# Altium schematic sheet Battery_Operated Node.SchDoc: Battery Oprated node
size OrCAD C; Date: 3/26/2015 6:39:54 PM; ApprovedBy: Approved By:; CheckedBy: Checked By:; Author: Auther:; CompanyName: Souliss; DrawnBy: Yoosof Piran; Engineer: Yoosof Piran; Revision: None; SheetNumber: 1; Design by:: Design by:Yoosof Piran; ProjectName: Battery Operated Nodes
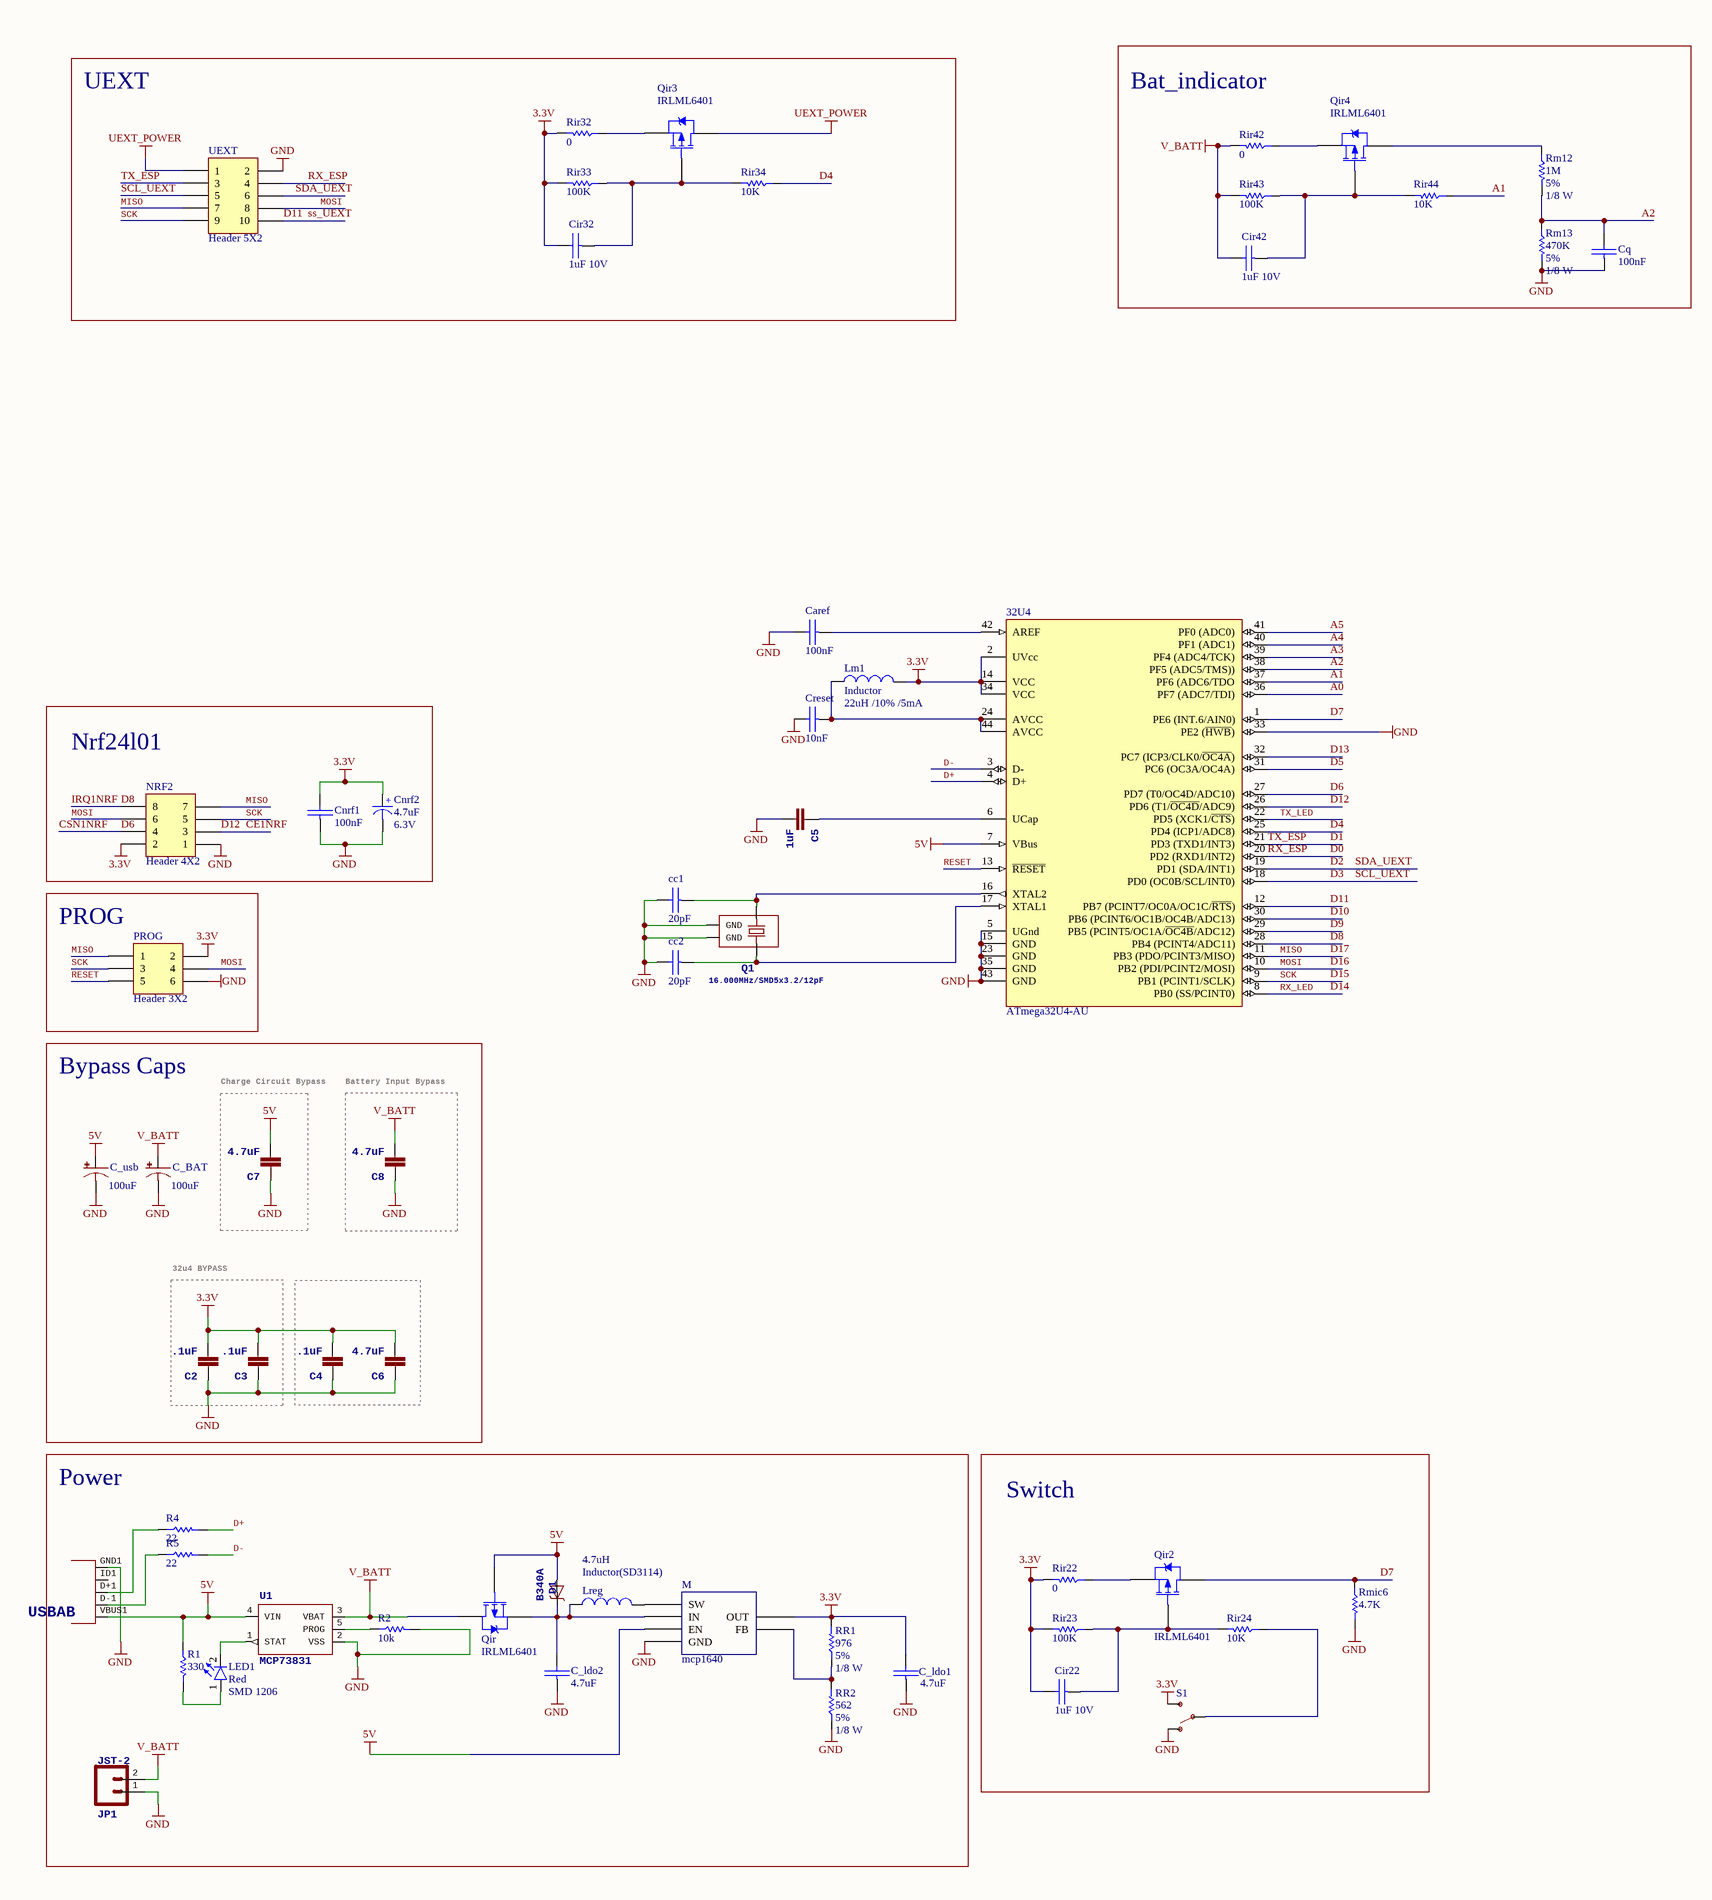
[diagram p0: Battery_Operated Node.SchDoc, left]
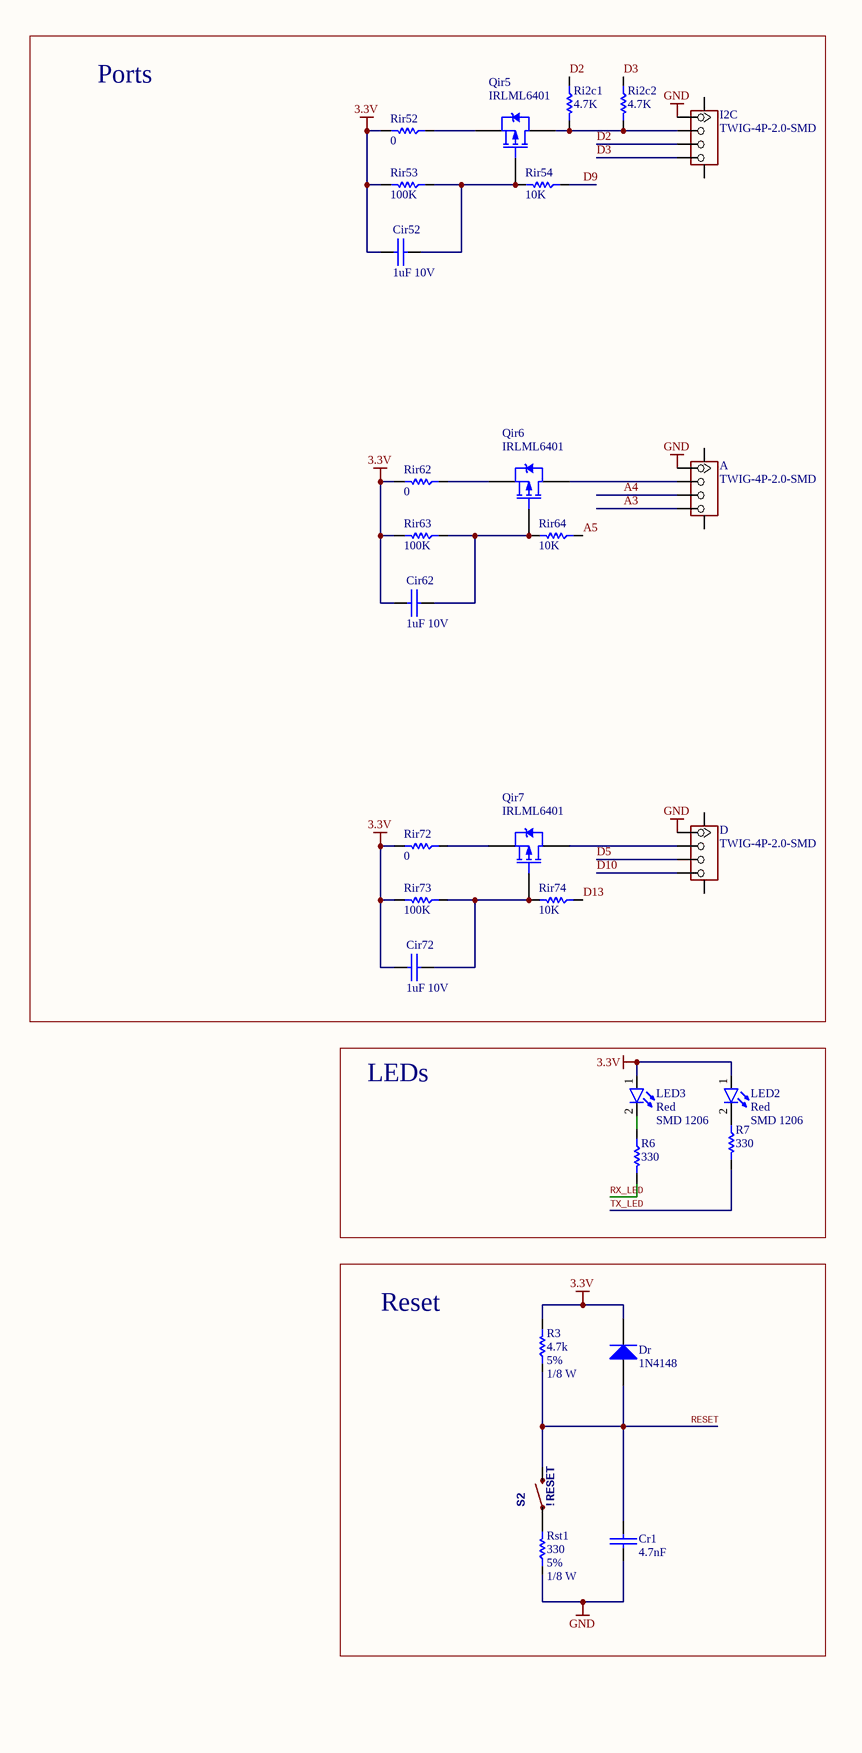
[diagram p1: Battery_Operated Node.SchDoc, right]

## Parts
32U4  ATmega32U4-AU  [44ML_N]
A  TWIG-4P-2.0-SMD  [4P-SMD-2.0]
C2  .1uF  [0603-CAP]
C3  .1uF  [0603-CAP]
C4  .1uF  [0603-CAP]
C5  1uF  [0603-CAP]
C6  4.7uF  [0603-CAP]
C7  4.7uF  [1206]
C8  4.7uF  [1206]
C_BAT  100uF  [PANASONIC_D]
C_ldo1  4.7uF  [SMD_CAP_1206]
C_ldo2  4.7uF  [SMD_CAP_1206]
C_usb  100uF  [PANASONIC_D]
Caref  100nF  [SMD_CAP_0805]
cc1  20pF  [SMD_CAP_0603]
cc2  20pF  [SMD_CAP_0603]
Cir22  1uF 10V  [SMD_CAP_0603]
Cir32  1uF 10V  [SMD_CAP_0805]
Cir42  1uF 10V  [SMD_CAP_0805]
Cir52  1uF 10V  [SMD_CAP_0805]
Cir62  1uF 10V  [SMD_CAP_0805]
Cir72  1uF 10V  [SMD_CAP_0805]
Cnrf1  100nF  [SMD_CAP_0805]
Cnrf2  Voltage: 6.3V  [CAPP 1206 (3216X18L) Size A]  (hidden comment: 4.7uF)
Cq  100nF  [SMD_CAP_0805]
Cr1  4.7nF  [SMD_CAP_0805]
Creset  10nF  [SMD_CAP_0805]
D  TWIG-4P-2.0-SMD  [4P-SMD-2.0]
D1  B340A  [SMA-DIODE]
Dr  1N4148  [LL4148]
I2C  TWIG-4P-2.0-SMD  [4P-SMD-2.0]
JP1  JST-2  [JST-2-SMD]
LED1  Size: SMD 1206  [LED SMD 1206]  (hidden comment: Red)
LED2  Size: SMD 1206  [LED SMD 1206]  (hidden comment: Red)
LED3  Size: SMD 1206  [LED SMD 1206]  (hidden comment: Red)
Lm1  Inductor  value 22uH /10% /5mA  [INDC3216]
Lreg  Inductor(SD3114)  value 4.7uH  [INDC4532]
M  mcp1640  [MCP1640]
NRF2  Header 4X2  [HDR2X4]
PROG  Header 3X2  [HDR2X3]
Q1  16.000MHz/SMD5x3.2/12pF  [CRYSTAL_SMD]
Qir  IRLML6401  [Micro3_N]
Qir2  IRLML6401  [Micro3_N]
Qir3  IRLML6401  [Micro3_N]
Qir4  IRLML6401  [Micro3_N]
Qir5  IRLML6401  [Micro3_N]
Qir6  IRLML6401  [Micro3_N]
Qir7  IRLML6401  [Micro3_N]
R1  330  [RES 0805 (2012X06L)]
R2  10k  [RES 0805 (2012X06L)]
R3  Tolerance: 5%  Power: 1/8 W  [RES 0805 (2012X06L)]  (hidden comment: 4.7k)
R4  22  [RES 0805 (2012X06L)]
R5  22  [RES 0805 (2012X06L)]
R6  330  [RES 0805 (2012X06L)]
R7  330  [RES 0805 (2012X06L)]
Ri2c1  4.7K  [RES 0603 (1608X06L)]
Ri2c2  4.7K  [RES 0603 (1608X06L)]
Rir22  0  [RES 0603 (1608X06L)]
Rir23  100K  [RES 0603 (1608X06L)]
Rir24  10K  [RES 0603 (1608X06L)]
Rir32  0  [RES 0805 (2012X06L)]
Rir33  100K  [RES 0805 (2012X06L)]
Rir34  10K  [RES 0805 (2012X06L)]
Rir42  0  [RES 0805 (2012X06L)]
Rir43  100K  [RES 0805 (2012X06L)]
Rir44  10K  [RES 0805 (2012X06L)]
Rir52  0  [RES 0805 (2012X06L)]
Rir53  100K  [RES 0805 (2012X06L)]
Rir54  10K  [RES 0805 (2012X06L)]
Rir62  0  [RES 0805 (2012X06L)]
Rir63  100K  [RES 0805 (2012X06L)]
Rir64  10K  [RES 0805 (2012X06L)]
Rir72  0  [RES 0805 (2012X06L)]
Rir73  100K  [RES 0805 (2012X06L)]
Rir74  10K  [RES 0805 (2012X06L)]
Rm12  Tolerance: 5%  Power: 1/8 W  [RES 0805 (2012X06L)]  (hidden comment: 1M)
Rm13  Tolerance: 5%  Power: 1/8 W  [RES 0805 (2012X06L)]  (hidden comment: 470K)
Rmic6  4.7K  [RES 0603 (1608X06L)]
RR1  Tolerance: 5%  Power: 1/8 W  [RES 0805 (2012X06L)]  (hidden comment: 976)
RR2  Tolerance: 5%  Power: 1/8 W  [RES 0805 (2012X06L)]  (hidden comment: 562)
Rst1  Tolerance: 5%  Power: 1/8 W  [RES 0805 (2012X06L)]  (hidden comment: 330)
S1  (no value)  [SWITCH-SPDT-SMD]
S2  !RESET  [TACTILE_SWITCH_SMD]
U1  MCP73831  [SOT23-5]
U5  USB-ABCONN-11794  [USB-AB-MICRO-SMD_V03]  (value not drawn)
UEXT  Header 5X2  [HDR2X5]

## Blocks framed on the sheet
Ports: A Cir52 Cir62 Cir72 D I2C Qir5-Qir7 Ri2c1 Ri2c2 Rir52-Rir54 Rir62-Rir64 Rir72-Rir74
UEXT: Cir32 Qir3 Rir32-Rir34 UEXT
Bat_indicator: Cir42 Cq Qir4 Rir42-Rir44 Rm12 Rm13
Nrf24l01: Cnrf1 Cnrf2 NRF2
PROG: PROG
LEDs: LED2 LED3 R6 R7
Bypass Caps: C4 C6 C_BAT C_usb
Charge Circuit Bypass: C7
Battery Input Bypass: C8
Reset: Cr1 Dr R3 Rst1 S2
32u4 BYPASS: C2 C3
Power: C_ldo1 C_ldo2 D1 JP1 LED1 Lreg M Qir R1 R2 R4 R5 RR1 RR2 U1 U5
Switch: Cir22 Qir2 Rir22-Rir24 Rmic6 S1

## Nets
3.3V: 32U4.2(UVcc) 32U4.14(VCC) 32U4.34(VCC) C2.2 C3.2 C4.2 C6.2 C_ldo1.1(+) Cir22.1(+) Cir32.1(+) Cir52.1(+) Cir62.1(+) Cir72.1(+) Cnrf1.1(+) Cnrf2.1(+) Dr.2(K) LED2.1(A) LED3.1(A) Lm1.2 M.5(OUT) NRF2.2 PROG.2 R3.2 Rir22.2 Rir23.2 Rir32.2 Rir33.2 Rir52.2 Rir53.2 Rir62.2 Rir63.2 Rir72.2 Rir73.2 RR1.2 S1.3(S)
5V: 32U4.7(VBus) C7.2 C_usb.+ D1.A M.3(EN) Qir.1(G) R1.1 U1.4(VIN) U5.VBUS1(VBUS)
GND: 32U4.5(UGnd) 32U4.15(GND) 32U4.23(GND) 32U4.33(PE2_(~{HWB})) 32U4.35(GND) 32U4.43(GND) A.1 C2.1 C3.1 C4.1 C5.2 C6.1 C7.1 C8.1 C_BAT.- C_ldo1.2(-) C_ldo2.2(-) C_usb.- Caref.1(+) cc1.1(+) cc2.1(+) Cnrf1.2(-) Cnrf2.2(-) Cq.2(-) Cr1.2(-) Creset.1(+) D.1 I2C.1 JP1.1 M.2(GND) NRF2.1 PROG.6 Q1.NC_1(GND) Q1.NC_2(GND) R2.2 Rm13.2 Rmic6.2 RR2.1 Rst1.1 S1.1(O) U1.2(VSS) U5.GND1(GND) UEXT.2
UEXT_POWER: Qir3.3(D) UEXT.1
V_BATT: C8.2 C_BAT.+ Cir42.1(+) JP1.2 Qir.3(D) Rir42.2 Rir43.2 U1.3(VBAT)
A0: 32U4.36(PF7_(ADC7/TDI))
A1: 32U4.37(PF6_(ADC6/TDO) Rir44.1
A2: 32U4.38(PF5_(ADC5/TMS))) Cq.1(+) Rm12.2 Rm13.1
A3: 32U4.39(PF4_(ADC4/TCK)) A.4
A4: 32U4.40(PF1_(ADC1)) A.3
A5: 32U4.41(PF0_(ADC0)) Rir64.1
CE1NRF: 32U4.26(PD6_(T1/~{OC4D}/ADC9)) NRF2.3  [also labelled D12]
CSN1NRF: 32U4.27(PD7_(T0/OC4D/ADC10)) NRF2.4  [also labelled D6]
D0: 32U4.20(PD2_(RXD1/INT2)) UEXT.4  [also labelled RX_ESP]
D1: 32U4.21(PD3_(TXD1/INT3)) UEXT.3  [also labelled TX_ESP]
D2: 32U4.19(PD1_(SDA/INT1)) I2C.3 Ri2c1.1 UEXT.6  [also labelled SDA_UEXT]
D3: 32U4.18(PD0_(OC0B/SCL/INT0)) I2C.4 Ri2c2.1 UEXT.5  [also labelled SCL_UEXT]
D4: 32U4.25(PD4_(ICP1/ADC8)) Rir34.1
D5: 32U4.31(PC6_(OC3A/OC4A)) D.3
D7: 32U4.1(PE6_(INT.6/AIN0)) Qir2.3(D) Rmic6.1
D8: 32U4.28(PB4_(PCINT4/ADC11)) NRF2.8  [also labelled IRQ1NRF]
D9: 32U4.29(PB5_(PCINT5/OC1A/~{OC4B}/ADC12)) Rir54.1
D10: 32U4.30(PB6_(PCINT6/OC1B/OC4B/ADC13)) D.4
D11: 32U4.12(PB7_(PCINT7/OC0A/OC1C/~{RTS})) UEXT.10  [also labelled ss_UEXT]
D13: 32U4.32(PC7_(ICP3/CLK0/~{OC4A})) Rir74.1
D14: 32U4.8(PB0_(SS/PCINT0)) R6.2  [also labelled RX_LED]
D15: 32U4.9(PB1_(PCINT1/SCLK)) NRF2.5 PROG.3 UEXT.9  [also labelled SCK]
D16: 32U4.10(PB2_(PDI/PCINT2/MOSI)) NRF2.6 PROG.4 UEXT.8  [also labelled MOSI]
D17: 32U4.11(PB3_(PDO/PCINT3/MISO)) NRF2.7 PROG.1 UEXT.7  [also labelled MISO]
D+: 32U4.4(D+) R4.2
D-: 32U4.3(D-) R5.2
RESET: 32U4.13(~{RESET}) Cr1.1(+) Dr.1(A) PROG.5 R3.1 S2.3
TX_LED: 32U4.22(PD5_(XCK1/~{CTS})) R7.2
Net32U4_6: 32U4.6(UCap) C5.1
Net32U4_16: 32U4.16(XTAL2) cc1.2(-) Q1.2
Net32U4_17: 32U4.17(XTAL1) cc2.2(-) Q1.1
Net32U4_24: 32U4.24(AVCC) 32U4.44(AVCC) Creset.2(-) Lm1.1
Net32U4_42: 32U4.42(AREF) Caref.2(-)
NetA_2: A.2 Qir6.3(D)
NetC_ldo2_1: C_ldo2.1(+) D1.C Lreg.1 M.6(IN) Qir.2(S)
NetCir22_2: Cir22.2(-) Qir2.1(G) Rir23.1 Rir24.2
NetCir32_2: Cir32.2(-) Qir3.1(G) Rir33.1 Rir34.2
NetCir42_2: Cir42.2(-) Qir4.1(G) Rir43.1 Rir44.2
NetCir52_2: Cir52.2(-) Qir5.1(G) Rir53.1 Rir54.2
NetCir62_2: Cir62.2(-) Qir6.1(G) Rir63.1 Rir64.2
NetCir72_2: Cir72.2(-) Qir7.1(G) Rir73.1 Rir74.2
NetD_2: D.2 Qir7.3(D)
NetI2C_2: I2C.2 Qir5.3(D) Ri2c1.2 Ri2c2.2
NetLED1_1: LED1.1(A) R1.2
NetLED1_2: LED1.2(K) U1.1(STAT)
NetLED2_2: LED2.2(K) R7.1
NetLED3_2: LED3.2(K) R6.1
NetLreg_2: Lreg.2 M.1(SW)
NetM_4: M.4(FB) RR1.1 RR2.2
NetQir2_2: Qir2.2(S) Rir22.1
NetQir3_2: Qir3.2(S) Rir32.1
NetQir4_2: Qir4.2(S) Rir42.1
NetQir4_3: Qir4.3(D) Rm12.1
NetQir5_2: Qir5.2(S) Rir52.1
NetQir6_2: Qir6.2(S) Rir62.1
NetQir7_2: Qir7.2(S) Rir72.1
NetR2_1: R2.1 U1.5(PROG)
NetR4_1: R4.1 U5.D+1(D+)
NetR5_1: R5.1 U5.D-1(D-)
NetRir24_1: Rir24.1 S1.2(P)
NetRst1_2: Rst1.2 S2.1

Not connected (* = marked no-connect by the designer): A SS1 SS2; D SS1 SS2; I2C SS1 SS2; U5 ID1(USBID)

## Notes on the sheet
- Title
- Size:
- Date:
- File:
- Orcad C
- Number:
- Time:
- Revision:
- Sheet
- of

## Library data of the parts
32U4 = ATmega32U4-AU: 8-bit AVR Microcontroller, 2.7-5.5V, 32KB Flash, 2.5KB EEPROM, 1KB SRAM, USB Controller, 44-pin TQFP, Industrial Grade (-40°C to 85°C); Published: 1-Apr-2010; DatasheetVersion: revD, Jan-2009; PackageVersion: rev.G, Jul-2007; PackageReference: 44ML; Publisher: Altium Limited; PackageDescription: 44-Pin Plastic Thin Quad Flat Pack, 10 x 10 x 1.0 mm Body, 0.8 mm Pitch (TQFP); Supplier 1: Digi-Key; Supplier Part Number 1: ATMEGA32U4-AU-ND; Supplier 2: Farnell; Supplier Part Number 2: 1748525; Supplier 3: Mouser; Supplier Part Number 3: 556-ATMEGA32U4-AU; ComponentLink1Description: Manufacturer Link; ComponentLink1URL: http://www.atmel.com/products/avr/default.asp?; ComponentLink2Description: ATmega16U4/32U4 Datasheet; ComponentLink2URL: http://www.atmel.com/dyn/resources/prod_documents/doc7766.pdf; ComponentLink3Description: ATmega16U4 ATmega32U4 Summary; ComponentLink3URL: http://www.atmel.com/dyn/resources/prod_documents/7766S.pdf; ComponentLink4Description: Atmel.com Home; ComponentLink4URL: http://www.atmel.com
A D I2C = TWIG-4P-2.0-SMD-FEMALE-REINFORCE'DD'
C2-C4 = CAP0603-CAP: ceramic capacitor; PROD_ID: CAP-00810
C5 = CAP0603-CAP: ceramic capacitor; PROD_ID: CAP-00868
C6 = CAP0603-CAP: ceramic capacitor; PROD_ID: CAP-08280
C7 C8 = CAP1206: ceramic capacitor; PROD_ID: CAP-10300
C_BAT C_usb = CAP_POLD: Polar Capacitor 6.3V; VALUE: 100uF
C_ldo1 C_ldo2 Caref cc1 cc2 Cir22 Cir32 Cir42 Cir52 Cir62 Cir72 Cnrf1 Cq Cr1 Creset = Cap-Bipolar: ceramic capacitor; Voltage: 100V; Designer: Saeid Jorablo; Organazation: ControTec; Adding Date: 1387/12/20
  C_ldo1 C_ldo2: Value: 4.7uF
  Caref Cnrf1 Cq: Value: 100nF
  cc1 cc2: Value: 20pF
  Cir22 Cir32 Cir42 Cir52 Cir62 Cir72: Value: 1uF 10V
  Cr1: Value: 4.7nF
  Creset: Value: 10nF
Cnrf2 = Cap-Polar: Polar Capacitor; Designer: Saeid Jorablo; Organazation: ControTec; Adding Date: 1387/12/20; Value: 4.7uF
D1 = DIODE-SCHOTTKY-B340A: Schottky diodes in SFE's production catalog<p> / BAT20J 1A 23V 0.62Vf<br> / RB751 120mA 40V 0.37Vf<br> / PMEG4005EJ 0.5A 40V 0.42Vf<br> / MBRA140 1A 40V 0.5Vf<br> / B340A  3A 40V SMA <br>
Dr = Diode 1N4148: High Conductance Fast Diode; Published: 8-Jun-2000; LatestRevisionDate: 17-Jul-2002; LatestRevisionNote: Re-released for DXP Platform.; DatasheetVersion: 1997; PackageReference: DO-35; Publisher: Altium Limited; PackageDescription: Diode, Axial; Body 3.8 x 1.9 mm (LxDia. max), Lead Dia. 0.53 mm (max); Code_JEDEC: DO-204-AH; ComponentLink1Description: Manufacturer Link; ComponentLink1URL: http://www.fairchildsemi.com/; ComponentLink2Description: Datasheet; ComponentLink2URL: http://www.fairchildsemi.com/ds/1N%2F1N4148.pdf
JP1 = M02-JST-2MM-SMT: Standard 2-pin 0.1" header. Use with <br> / - straight break away headers ( PRT-00116)<br> / - right angle break away headers (PRT-00553)<br> / - swiss pins (PRT-00743)<br> / - machine pins (PRT-00117)<br> / - female headers (PRT-00115)<br><br> / Molex polarized connector foot print use with: PRT-08233 with associated crimp pins and housings.<br><br> / 2.54_SCREWTERM for use with  PRT-10571.<br><br> / 3.5mm Screw Terminal footprints for  PRT-08084<br><br> / 5mm Screw Terminal footprints for use with PRT-08433; PROD_ID: CONN-08352
LED1-LED3 = LED: Designer: Saeid Jorablo; Organazation: ControTec; Adding Date: 1387/12/22; Color: Red
Lm1 = Inductor: Code_IEC: 1005; Published: 8-Jun-2000; LatestRevisionDate: 29-May-2009; LatestRevisionNote: IPC-7351 Footprint Added.; PackageReference: 0402-A; Publisher: Altium Limited; PackageDescription: Chip Inductor; Code_JEITA: 0402
Lreg = Inductor: Inductor SD3114; Code_IEC: 1005; Published: 8-Jun-2000; LatestRevisionDate: 29-May-2009; LatestRevisionNote: IPC-7351 Footprint Added.; PackageReference: 0402-A; Publisher: Altium Limited; PackageDescription: Chip Inductor; Code_JEITA: 0402
M = mcp1640: MCP1640DT-I/CHY , 0.65V, Sync Reg., 6LD SOT-23 pkg
NRF2 = Header 4X2: Header, 4-Pin, Dual row; Revision: 17-Jul-2002: Re-released for DXP Platform.; Publisher: Altium Limited
PROG = Header 3X2: Header, 3-Pin, Dual row; Revision: 17-Jul-2002: Re-released for DXP Platform.; Publisher: Altium Limited
Q1 = SMALL_SMD_CRYSTAL
Qir Qir2-Qir7 = IRLML6401: HEXFET Power MOSFET; Published: 17-Sep-2003; DatasheetVersion: 2-Jul-2001; PackageVersion: Jul-2001; PackageReference: Micro3; Publisher: Altium Limited; PackageDescription: 3-Pin SOT-23 Package 0.95 mm Pitch, 2.3 mm Lead Span; ComponentLink1Description: Manufacturer Link; ComponentLink1URL: http://www.irf.com/; ComponentLink2Description: Datasheet; ComponentLink2URL: http://www.irf.com/product-info/datasheets/data/IRLML6401.pdf
R1 R2 R4-R7 Ri2c1 Ri2c2 Rir22 Rir23 Rir32 Rir33 Rir42 Rir43 Rir52 Rir53 Rir62 Rir63 Rir72 Rir73 Rmic6 = Resistor: Tolerance: 5%; Power: 1/8 W
  R1 R6 R7: Value: 330
  R2: Value: 10k
  R4 R5: Value: 22
  Ri2c1 Ri2c2 Rmic6: Value: 4.7K
  Rir22 Rir32 Rir42 Rir52 Rir62 Rir72: Value: 0
  Rir23 Rir33 Rir43 Rir53 Rir63 Rir73: Value: 100K
R3 Rm12 Rm13 RR1 RR2 Rst1 = Resistor
  R3: Value: 4.7k
  Rm12: Value: 1M
  Rm13: Value: 470K
  RR1: Value: 976
  RR2: Value: 562
  Rst1: Value: 330
Rir24 Rir34 Rir44 Rir54 Rir64 Rir74 = Resistor: Power: 1/8 W; Value: 10K
S1 = SWITCH-SPDTSMD2
S2 = SWITCH-MOMENTARY-2SMD: Various NO switches- pushbuttons, reed, etc
U1 = MCP73831: Miniature single cell, fully integrated Li-Ion, Li-polymer charge management controller<br> / http://ww1.microchip.com/downloads/en/DeviceDoc/21984a.pdf<br> / IC-09995; PROD_ID: IC-09995
U5 = USB-ABCONN-11794: This is a USB AB connector that is compatible with USB OTG. i.e. this connector can serve as a host or device; PROD_ID: CONN-11794; USBAB: USBAB
UEXT = Header 5X2: Header, 5-Pin, Dual row; Revision: 17-Jul-2002: Re-released for DXP Platform.; Publisher: Altium Limited